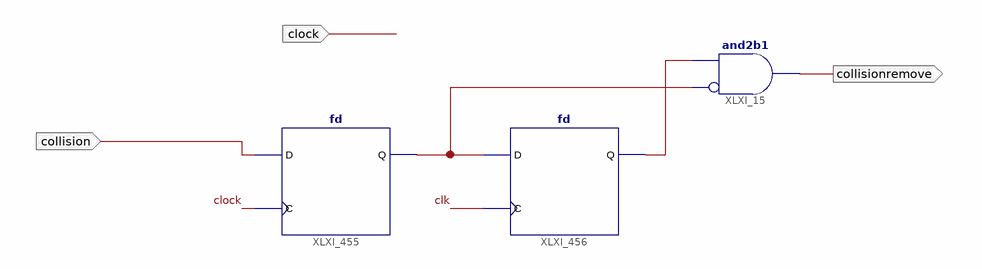
[diagram p0: schematic sheet 1]
// Xilinx ISE schematic collisionholdedgedet.sch (spartan3e) as structural Verilog: 3 symbols, 3 ports
module collisionholdedgedet (
  input  clock,
  input  collision,
  output collisionremove
);

  wire clk, XLXN_58, XLXN_59;

  and XLXI_15 (collisionremove, ~XLXN_58, XLXN_59);  // and2b1
  fd XLXI_455 (.C(clock), .D(collision), .Q(XLXN_58));
  fd XLXI_456 (.C(clk), .D(XLXN_58), .Q(XLXN_59));
endmodule
